# EAGLE design mainboard (EAGLE 5.11)

## Sheet 1 of 3
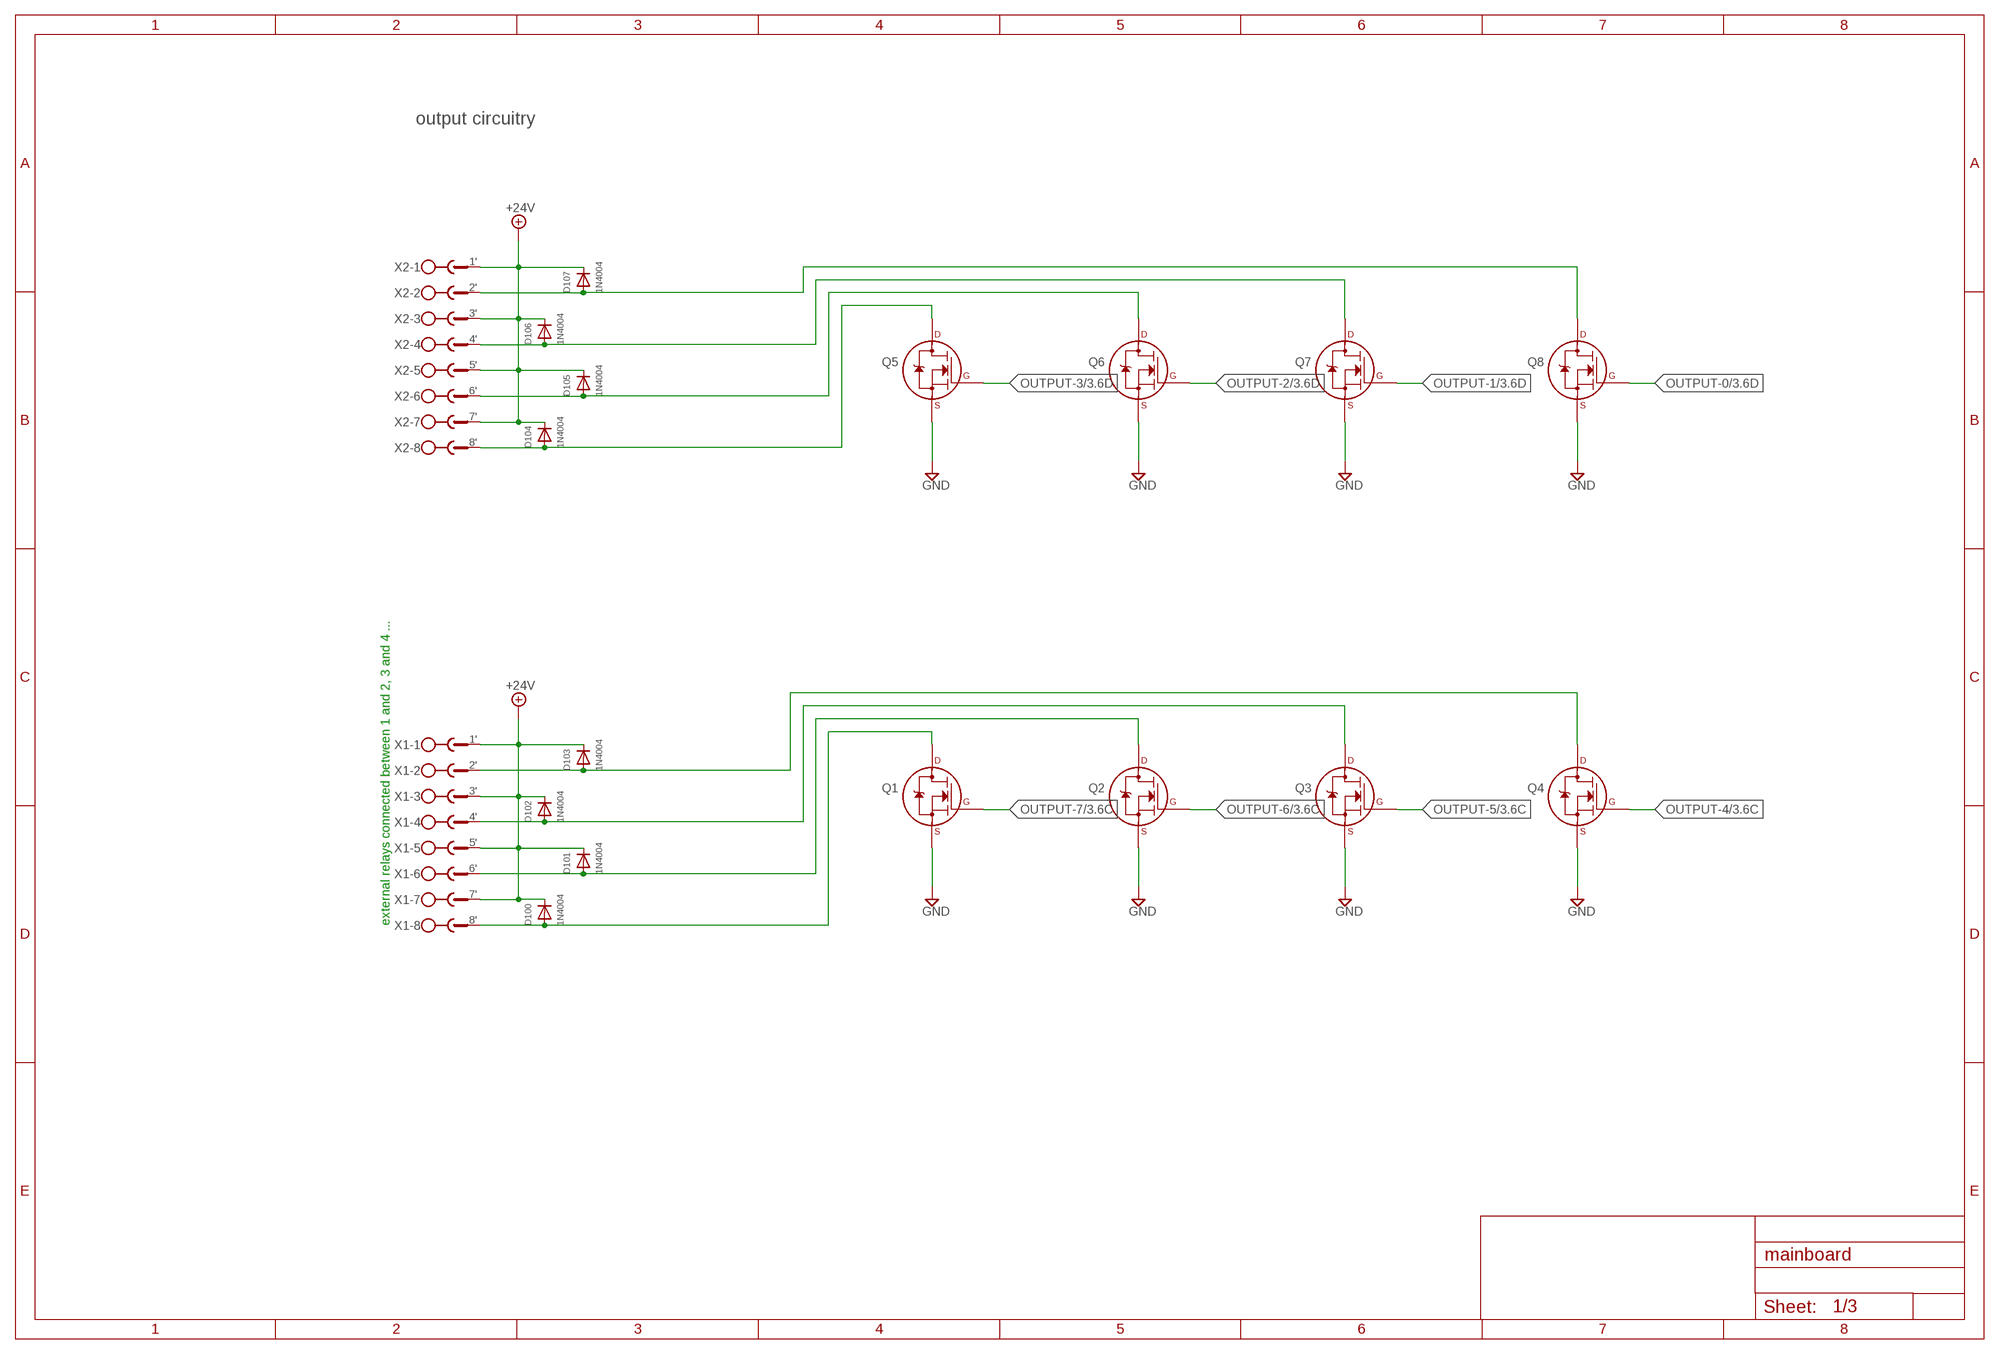
[diagram p0: schematic, sheet 1]

### Parts
D100  1N4004  DIODESMA  [SMADIODE]
D101  1N4004  DIODESMA  [SMADIODE]
D102  1N4004  DIODESMA  [SMADIODE]
D103  1N4004  DIODESMA  [SMADIODE]
D104  1N4004  DIODESMA  [SMADIODE]
D105  1N4004  DIODESMA  [SMADIODE]
D106  1N4004  DIODESMA  [SMADIODE]
D107  1N4004  DIODESMA  [SMADIODE]
Q1  2N7000_TO92  [TO-92]
Q2  2N7000_TO92  [TO-92]
Q3  2N7000_TO92  [TO-92]
Q4  2N7000_TO92  [TO-92]
Q5  2N7000_TO92  [TO-92]
Q6  2N7000_TO92  [TO-92]
Q7  2N7000_TO92  [TO-92]
Q8  2N7000_TO92  [TO-92]
X1  MSTBA8  [MSTBA8]
X2  MSTBA8  [MSTBA8]

### Nets
+24V: D100.C D101.C D102.C D103.C D104.C D105.C D106.C D107.C X1.1' X1.3' X1.5' X1.7' X2.1' X2.3' X2.5' X2.7' ; also sheet 2,3
GND: Q1.1(S) Q2.1(S) Q3.1(S) Q4.1(S) Q5.1(S) Q6.1(S) Q7.1(S) Q8.1(S) ; also sheet 2,3
N$2: D107.A Q8.3(D) X2.2'
N$4: D105.A Q6.3(D) X2.6'
N$5: D104.A Q5.3(D) X2.8'
N$6: D103.A Q4.3(D) X1.2'
N$8: D101.A Q2.3(D) X1.6'
N$9: D100.A Q1.3(D) X1.8'
N$11: D106.A Q7.3(D) X2.4'
N$12: D102.A Q3.3(D) X1.4'
OUTPUT-0: Q8.2(G) ; also sheet 3
OUTPUT-1: Q7.2(G) ; also sheet 3
OUTPUT-2: Q6.2(G) ; also sheet 3
OUTPUT-3: Q5.2(G) ; also sheet 3
OUTPUT-4: Q4.2(G) ; also sheet 3
OUTPUT-5: Q3.2(G) ; also sheet 3
OUTPUT-6: Q2.2(G) ; also sheet 3
OUTPUT-7: Q1.2(G) ; also sheet 3

### Notes on the sheet
- output circuitry
- external relays connected between 1 and 2, 3 and 4 ...

## Sheet 2 of 3
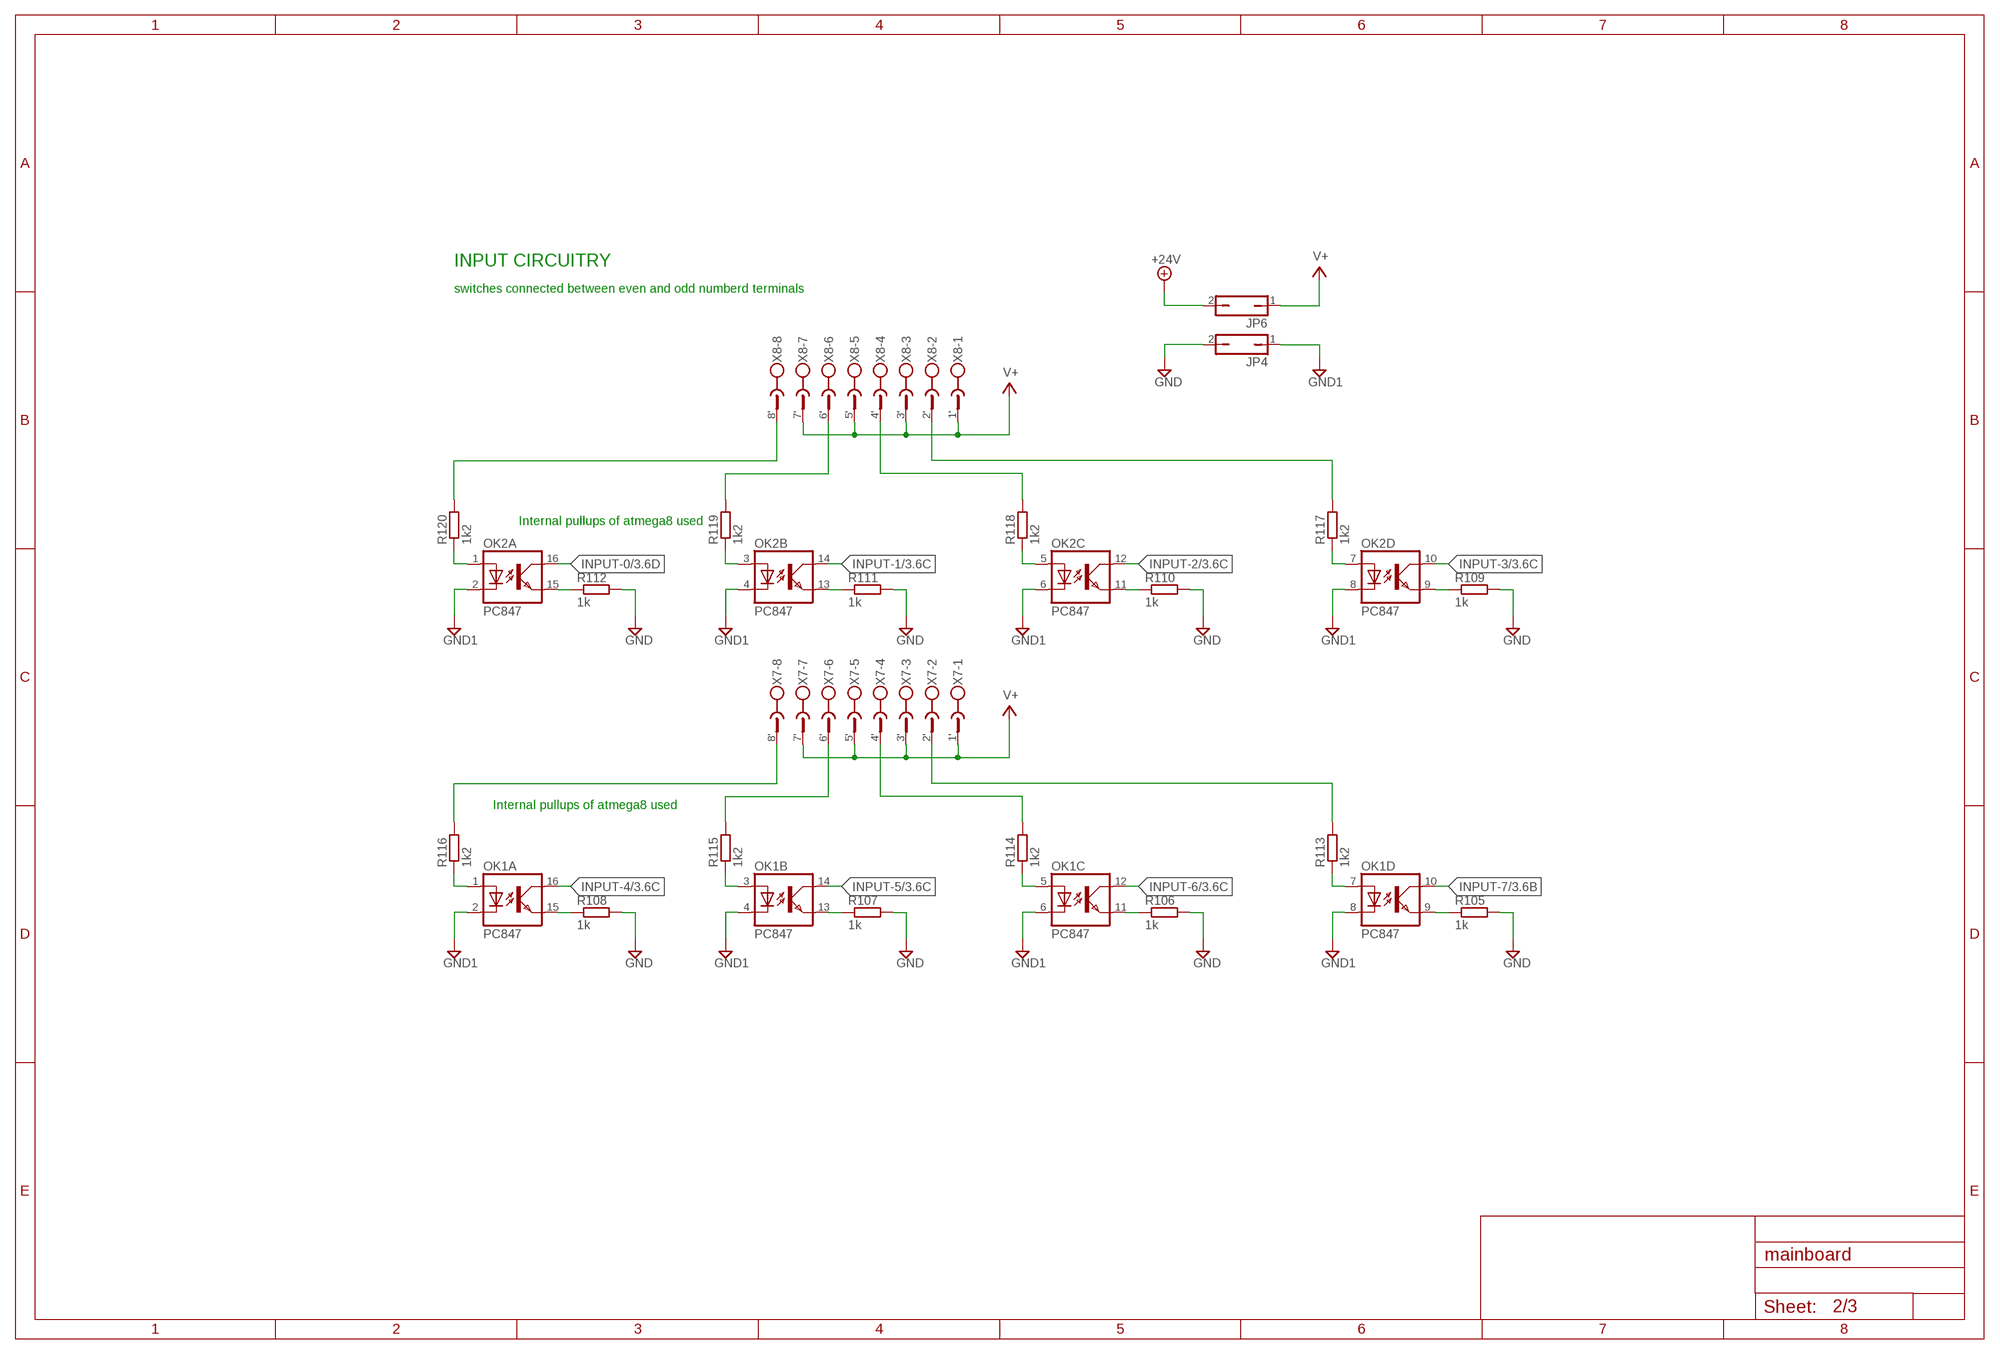
[diagram p1: schematic, sheet 2]

### Parts
JP4  JP1Q  [JP1]
JP6  JP1Q  [JP1]
OK1  PC847  [DIL16]
OK2  PC847  [DIL16]
R105  1k  R-EU_R0805  [R0805]
R106  1k  R-EU_R0805  [R0805]
R107  1k  R-EU_R0805  [R0805]
R108  1k  R-EU_R0805  [R0805]
R109  1k  R-EU_R0805  [R0805]
R110  1k  R-EU_R0805  [R0805]
R111  1k  R-EU_R0805  [R0805]
R112  1k  R-EU_R0805  [R0805]
R113  1k2  R-EU_R1206  [R1206]
R114  1k2  R-EU_R1206  [R1206]
R115  1k2  R-EU_R1206  [R1206]
R116  1k2  R-EU_R1206  [R1206]
R117  1k2  R-EU_R1206  [R1206]
R118  1k2  R-EU_R1206  [R1206]
R119  1k2  R-EU_R1206  [R1206]
R120  1k2  R-EU_R1206  [R1206]
X7  MSTBA8  [MSTBA8]
X8  MSTBA8  [MSTBA8]

### Nets
+24V: JP6.2 ; also sheet 1,3
GND: JP4.2 R105.2 R106.2 R107.2 R108.2 R109.2 R110.2 R111.2 R112.2 ; also sheet 1,3
GND1: JP4.1 OK1.2(A:C) OK1.4(B:C) OK1.6(C:C) OK1.8(D:C) OK2.2(A:C) OK2.4(B:C) OK2.6(C:C) OK2.8(D:C) ; also sheet 3
INPUT-0: OK2.16(A:COL) ; also sheet 3
INPUT-1: OK2.14(B:COL) ; also sheet 3
INPUT-2: OK2.12(C:COL) ; also sheet 3
INPUT-3: OK2.10(D:COL) ; also sheet 3
INPUT-4: OK1.16(A:COL) ; also sheet 3
INPUT-5: OK1.14(B:COL) ; also sheet 3
INPUT-6: OK1.12(C:COL) ; also sheet 3
INPUT-7: OK1.10(D:COL) ; also sheet 3
N$1: OK2.1(A:A) R120.1
N$3: OK2.3(B:A) R119.1
N$7: OK2.5(C:A) R118.1
N$10: OK2.7(D:A) R117.1
N$14: R120.2 X8.8'
N$15: R119.2 X8.6'
N$16: R118.2 X8.4'
N$17: R117.2 X8.2'
N$18: OK1.1(A:A) R116.1
N$19: OK1.3(B:A) R115.1
N$20: OK1.5(C:A) R114.1
N$21: OK1.7(D:A) R113.1
N$22: R116.2 X7.8'
N$23: R115.2 X7.6'
N$24: R114.2 X7.4'
N$25: R113.2 X7.2'
N$44: OK2.15(A:EMIT) R112.1
N$45: OK2.13(B:EMIT) R111.1
N$46: OK2.11(C:EMIT) R110.1
N$47: OK2.9(D:EMIT) R109.1
N$48: OK1.15(A:EMIT) R108.1
N$49: OK1.13(B:EMIT) R107.1
N$50: OK1.11(C:EMIT) R106.1
N$51: OK1.9(D:EMIT) R105.1
V+: JP6.1 X7.1' X7.3' X7.5' X7.7' X8.1' X8.3' X8.5' X8.7' ; also sheet 3

### Notes on the sheet
- INPUT CIRCUITRY
- switches connected between even and odd numberd terminals
- Internal pullups of atmega8 used
- Internal pullups of atmega8 used

## Sheet 3 of 3
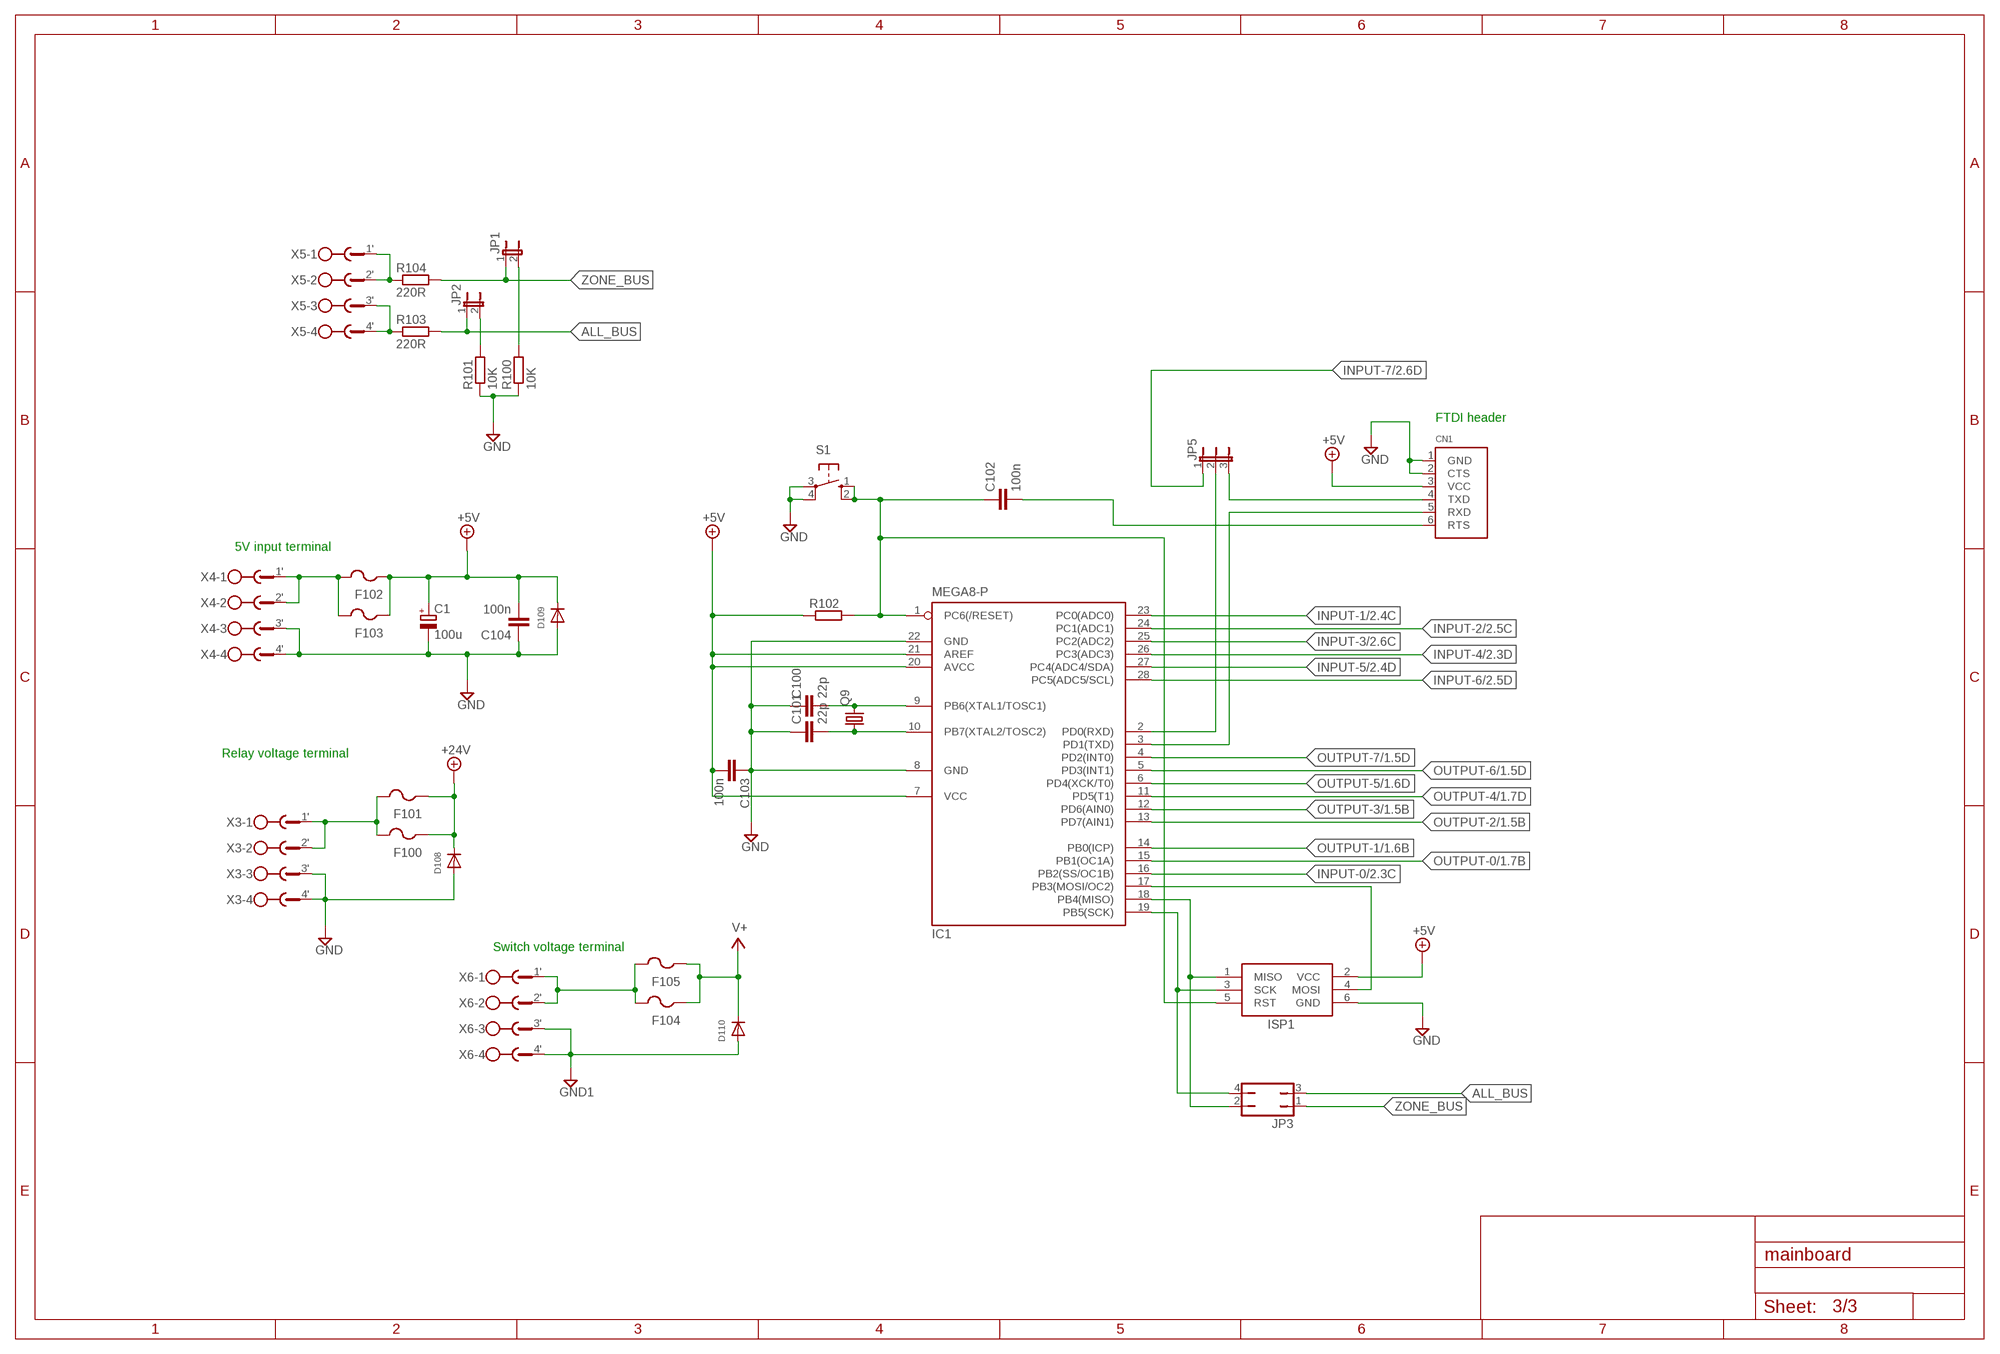
[diagram p2: schematic, sheet 3]

### Parts
C1  100u  CPOL-EUE5-8.5  [E5-8,5]
C100  22p  C-EUC0805  [C0805]
C101  22p  C-EUC0805  [C0805]
C102  100n  C-EUC0805  [C0805]
C103  100n  C-EUC0805  [C0805]
C104  100n  C-EUC0805  [C0805]
CN1  FTDIUSBCABLE  [1X06_ROUND]
D108  DIODESMA  [SMADIODE]
D109  DIODESMA  [SMADIODE]
D110  DIODESMA  [SMADIODE]
F100  PTCFUSE-1206  [R1206]
F101  PTCFUSE-1812  [1812]
F102  PTCFUSE-1812  [1812]
F103  PTCFUSE-1206  [R1206]
F104  PTCFUSE-1206  [R1206]
F105  PTCFUSE-1812  [1812]
IC1  MEGA8-P  [DIL28-3]
ISP1  AVRISP-6  [AVRISP]
JP1  JP1E  [JP1]
JP2  JP1E  [JP1]
JP3  JP2Q  [JP2Q]
JP5  JP2E  [JP2]
Q9  CRYSTALHC49S  [HC49/S]
R100  10K  R-EU_R0805  [R0805]
R101  10K  R-EU_R0805  [R0805]
R102  R-EU_R0805  [R0805]
R103  220R  R-EU_R0805  [R0805]
R104  220R  R-EU_R0805  [R0805]
S1  10-XX  [B3F-10XX]
X3  MSTBA4  [MSTBA4]
X4  MSTBA4  [MSTBA4]
X5  MSTBA4  [MSTBA4]
X6  MSTBA4  [MSTBA4]

### Nets
+5V: C1.+ C103.2 C104.2 CN1.3(VCC) D109.C F102.1 F103.1 IC1.7(VCC) IC1.20(AVCC) IC1.21(AREF) ISP1.2(VCC) R102.1
+24V: D108.C F100.1 F101.1 ; also sheet 1,2
ALL_BUS: JP2.1 JP3.3 R103.2
ALL_EXTERNAL: R103.1 X5.3' X5.4'
GND: C1.- C100.1 C101.1 C103.1 C104.1 CN1.1(GND) CN1.2(CTS) D108.A D109.A IC1.8(GND) IC1.22(GND) ISP1.6(GND) R100.1 R101.1 S1.3(P) S1.4(P1) X3.3' X3.4' X4.3' X4.4' ; also sheet 1,2
GND1: D110.A X6.3' X6.4' ; also sheet 2
INPUT-0: IC1.16(PB2(SS/OC1B)) ; also sheet 2
INPUT-1: IC1.23(PC0(ADC0)) ; also sheet 2
INPUT-2: IC1.24(PC1(ADC1)) ; also sheet 2
INPUT-3: IC1.25(PC2(ADC2)) ; also sheet 2
INPUT-4: IC1.26(PC3(ADC3)) ; also sheet 2
INPUT-5: IC1.27(PC4(ADC4/SDA)) ; also sheet 2
INPUT-6: IC1.28(PC5(ADC5/SCL)) ; also sheet 2
INPUT-7: JP5.1 ; also sheet 2
N$13: C102.1 IC1.1(PC6(/RESET)) ISP1.5(RST) R102.2 S1.1(S) S1.2(S1)
N$26: C101.2 IC1.10(PB7(XTAL2/TOSC2)) Q9.1
N$27: C100.2 IC1.9(PB6(XTAL1/TOSC1)) Q9.2
N$29: C102.2 CN1.6(RTS)
N$30: CN1.4(TXD) JP5.3
N$32: IC1.18(PB4(MISO)) ISP1.1(MISO) JP3.2
N$33: IC1.19(PB5(SCK)) ISP1.3(SCK) JP3.4
N$34: F100.2 F101.2 X3.1' X3.2'
N$35: IC1.17(PB3(MOSI/OC2)) ISP1.4(MOSI)
N$36: F104.2 F105.2 X6.1' X6.2'
N$41: F102.2 F103.2 X4.1' X4.2'
N$42: JP2.2 R101.2
N$43: JP1.2 R100.2
OUTPUT-0: IC1.15(PB1(OC1A)) ; also sheet 1
OUTPUT-1: IC1.14(PB0(ICP)) ; also sheet 1
OUTPUT-2: IC1.13(PD7(AIN1)) ; also sheet 1
OUTPUT-3: IC1.12(PD6(AIN0)) ; also sheet 1
OUTPUT-4: IC1.11(PD5(T1)) ; also sheet 1
OUTPUT-5: IC1.6(PD4(XCK/T0)) ; also sheet 1
OUTPUT-6: IC1.5(PD3(INT1)) ; also sheet 1
OUTPUT-7: IC1.4(PD2(INT0)) ; also sheet 1
RX: IC1.2(PD0(RXD)) JP5.2
TX: CN1.5(RXD) IC1.3(PD1(TXD))
V+: D110.C F104.1 F105.1 ; also sheet 2
ZONE_BUS: JP1.1 JP3.1 R104.2
ZONE_EXTERNAL: R104.1 X5.1' X5.2'

### Notes on the sheet
- FTDI header
- 5V input terminal
- Relay voltage terminal
- Switch voltage terminal

## Library data of the parts
C1 = resistor:CPOL-EU: POLARIZED CAPACITOR, European symbol
C100-C104 = resistor:C-EU: CAPACITOR, European symbol
CN1 = microbuilder:FTDIUSBCABLE: FTDI TTL-232R USB Cable Connector for FTDI's USB->RS232 Cable
D100-D108 D110 = microbuilder:DIODE: Diode
D109 = adafruit:DIODE: Diode
F100-F105 = adafruit:PTCFUSE: PTC fuses, resettable thermistors
IC1 = atmel:MEGA8-P: MICROCONTROLLER 8 Kbytes FLASH, 1 kbytes SRAM, 512 bytes EEPROM, USART, 4-channel 10 bit ADC, 2-channel 8 bit ADC Pin compatible with Atmega48, ATMega88, ATMega168 Source: avr.lbr; OC_FARNELL: unknown; OC_NEWARK: unknown
ISP1 = adafruit:AVRISP: AVR ISP HEADER Standard 6 pin header for AVR programming
JP1 JP2 = jumper:JP1E: JUMPER
JP3 = jumper:JP2Q: JUMPER
JP4 JP6 = jumper:JP1Q: JUMPER
JP5 = jumper:JP2E: JUMPER
OK1 OK2 = optocoupler:PC847: SHARP OPTO COUPLER; OC_FARNELL: 9707735; OC_NEWARK: unknown
Q1-Q8 = transistors2:2N700*: 2N7000, 2N7002, NDS7002A N-channel enhancement mode MOSFET
Q9 = crystal:CRYSTAL: CRYSTAL; OC_FARNELL: 1667008; OC_NEWARK: unknown
R100-R120 = resistor:R-EU_: RESISTOR, European symbol
S1 = switch-omron:10-XX: OMRON SWITCH; MPN: B3F-1000; OC_FARNELL: 176432; OC_NEWARK: 36M3542
X1 X2 X7 X8 = con-phoenix-508-mod:MSTBA8: PHOENIX; MF: FARNELL; MPN: 1757307; OC_FARNELL: 3705225; OC_NEWARK: 71C4166
X3-X6 = con-phoenix-508-mod:MSTBA4: PHOENIX; MF: FARNELL; MPN: 1757268; OC_FARNELL: 3705195; OC_NEWARK: 71C4163

## Board
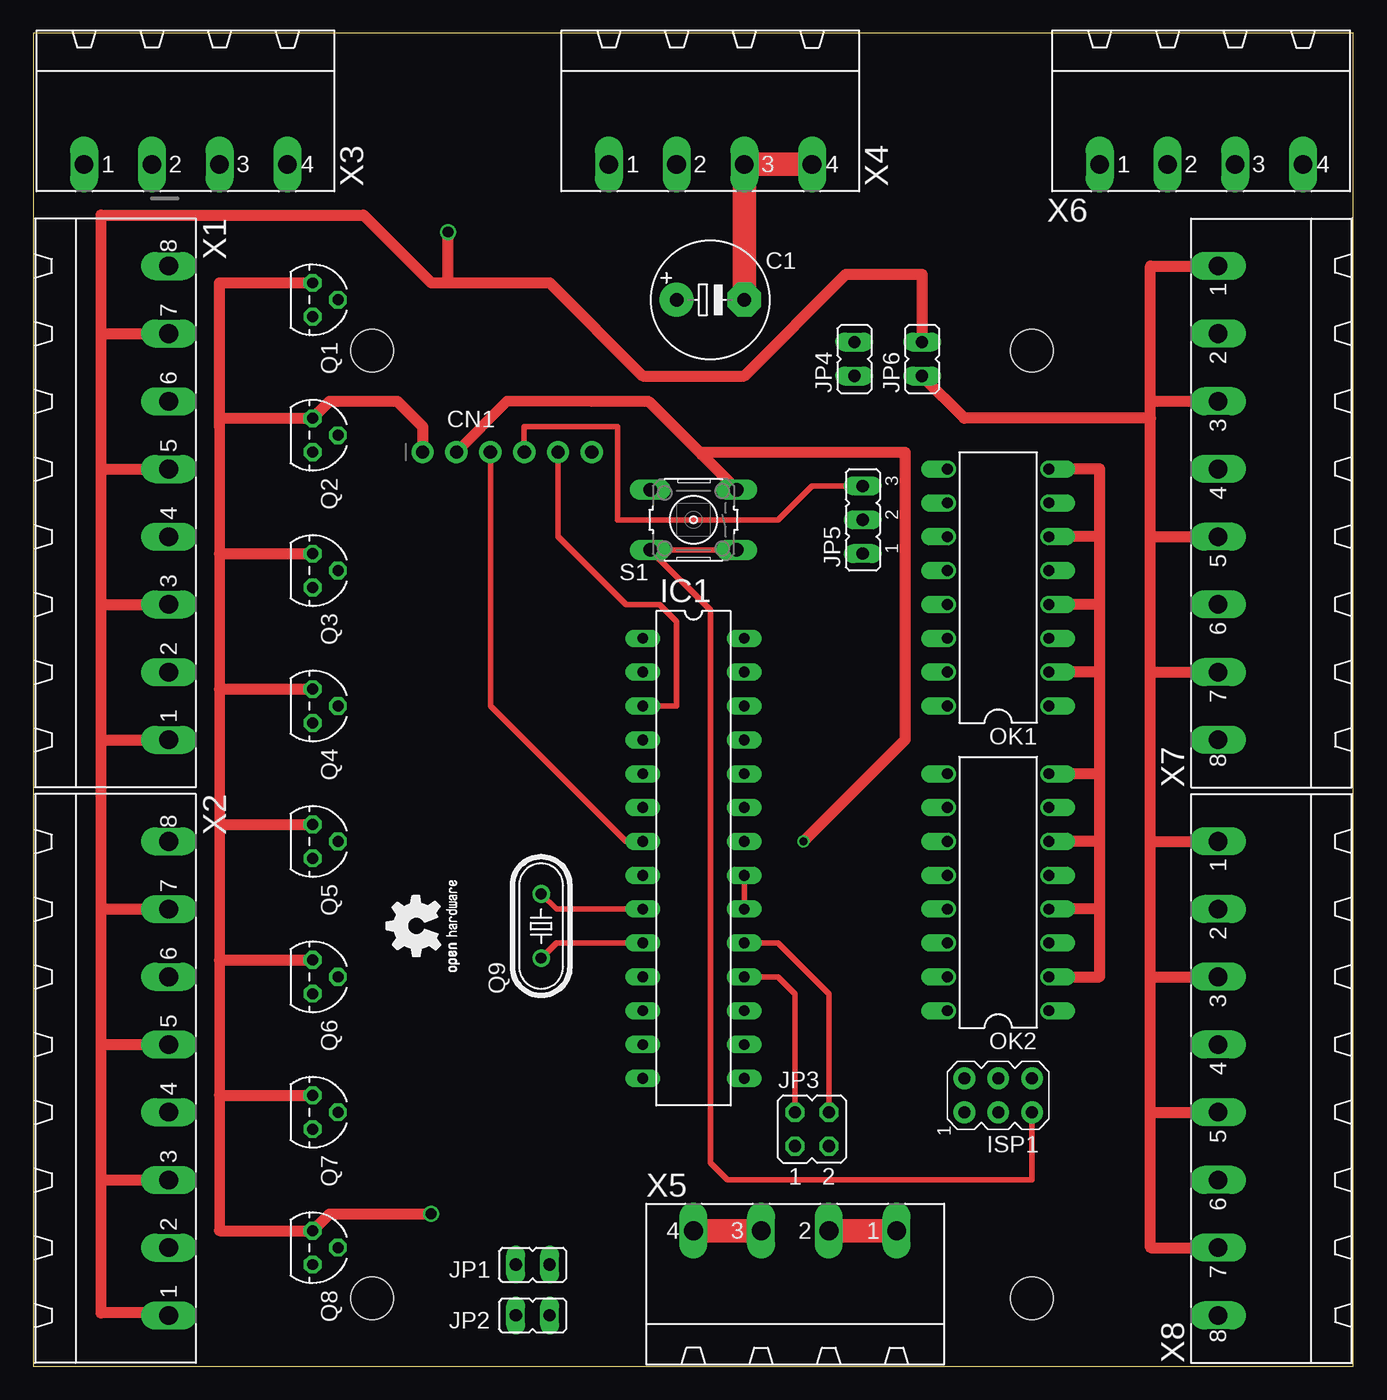
[diagram p3: board, top side]
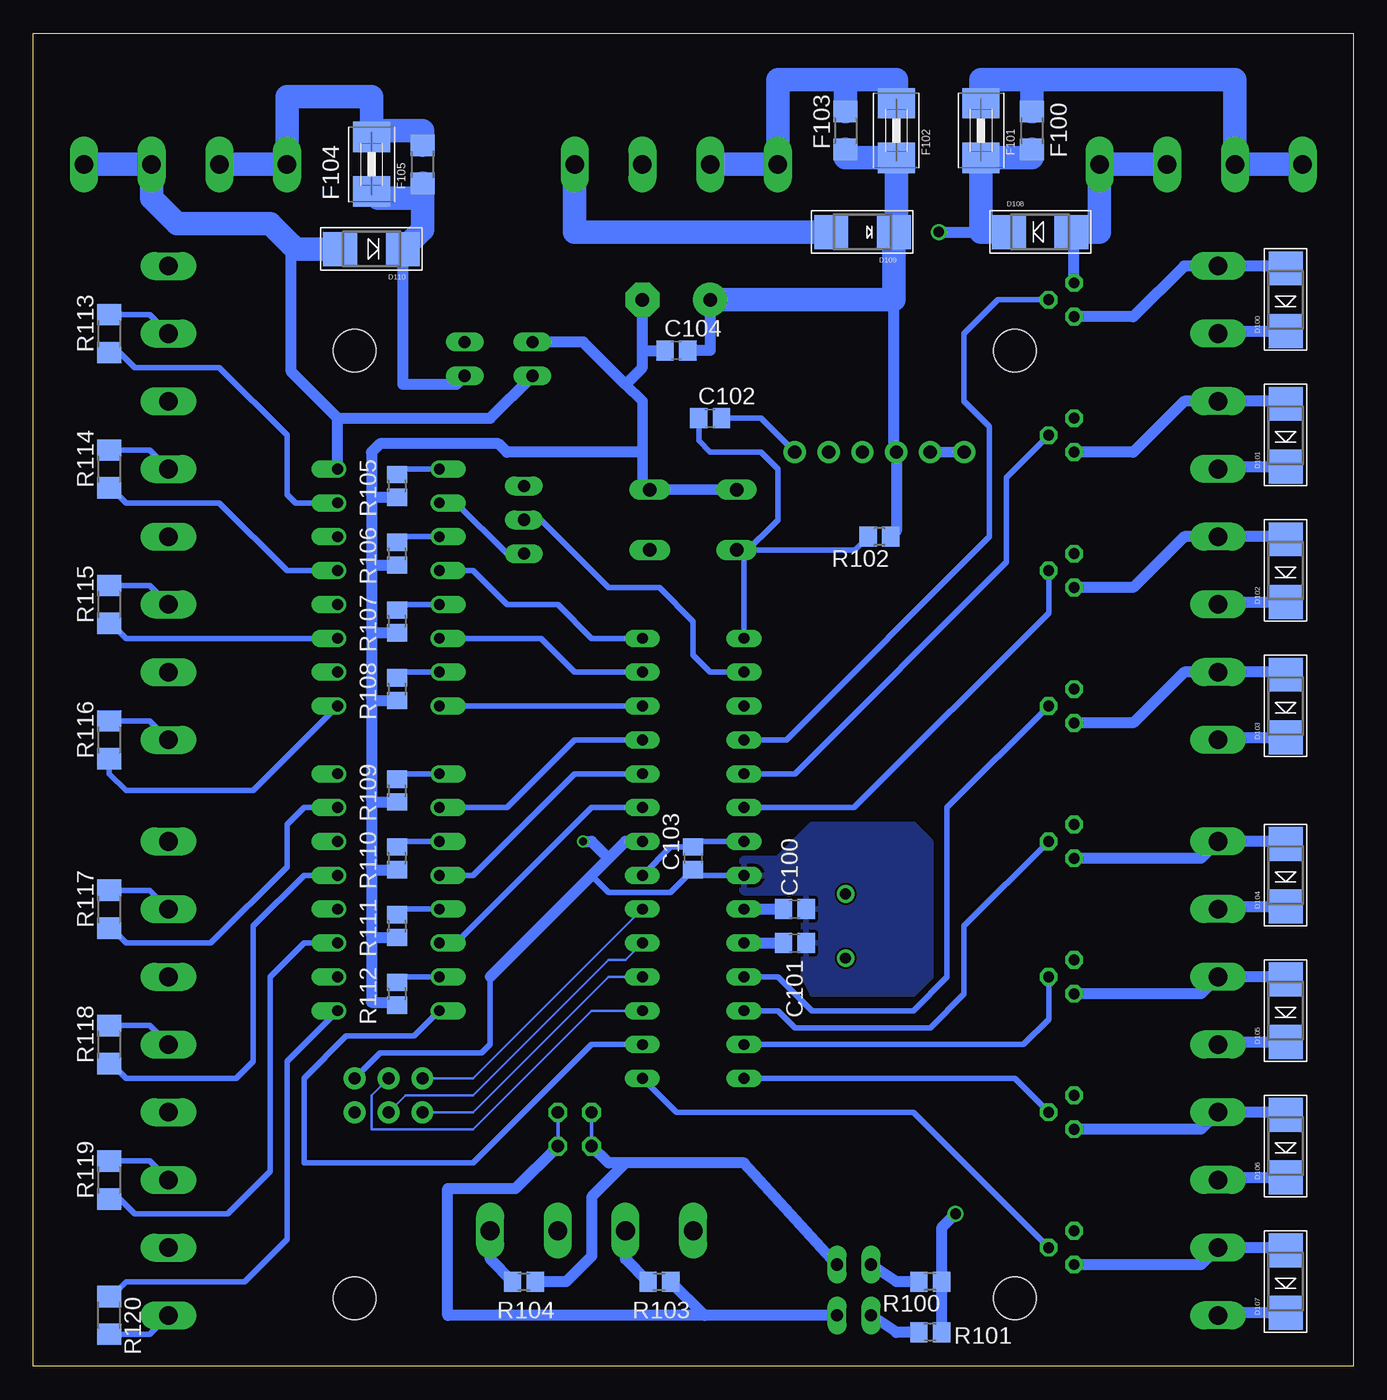
[diagram p4: board, bottom side, seen from below]

Size 99.04 x 100 mm. Coordinates in mm from the lower left corner, seen from the top.
Outline: 0,0 99.04,0 99.04,100 0,100 0,0
Copper layers (1*16): Top 0.035mm / dielectric 1.5mm / Bottom 0.035mm
Design rules "ITEADstudio_DRC": minimum track width 6mil, minimum drill 12mil, track to track 6mil, track to pad 6mil, pad to pad 6mil, via to via 6mil, smd to smd 0mil, copper to edge 10mil, drill to drill 10mil, minimum pad ring 10mil, minimum via ring 6mil, stop-mask expansion 2mil, vias tented up to drill 100mil, thermal gap 10mil
Holes 3.2 mm at 25.4,76.2 74.93,76.2 25.4,5.08 74.93,5.08

### Footprints (pad centres in the part's own frame; a part is rotated, then mirrored left to right if it is on the bottom)
E5-8,5 = drill 1.016 pad 2.54 round: + -2.54,0 | drill 1.016 pad 2.54 octagon: - 2.54,0
C0805 = smd 1.3 x 1.5: 1 -0.85,0; 2 0.85,0
1X06_ROUND = drill 1 pad 1.676 round: 1 -6.35,0; 2 -3.81,0; 3 -1.27,0; 4 1.27,0; 5 3.81,0; 6 6.35,0
SMADIODE = smd 2.54 x 2.54: A 2.349,0; C -2.349,0
R1206 = smd 1.6 x 1.803: 1 -1.422,0; 2 1.422,0
1812 = smd 2.286 x 2.794: 1 -2.046,0; 2 2.046,0
DIL28-3 = drill 0.813 long: 1 -16.51,-3.81; 2 -13.97,-3.81; 3 -11.43,-3.81; 4 -8.89,-3.81; 5 -6.35,-3.81; 6 -3.81,-3.81; 7 -1.27,-3.81; 8 1.27,-3.81; 9 3.81,-3.81; 10 6.35,-3.81; 11 8.89,-3.81; 12 11.43,-3.81; 13 13.97,-3.81; 14 16.51,-3.81; 15 16.51,3.81; 16 13.97,3.81; 17 11.43,3.81; 18 8.89,3.81; 19 6.35,3.81; 20 3.81,3.81; 21 1.27,3.81; 22 -1.27,3.81; 23 -3.81,3.81; 24 -6.35,3.81; 25 -8.89,3.81; 26 -11.43,3.81; 27 -13.97,3.81; 28 -16.51,3.81
AVRISP = drill 0.9 pad 1.626 round: 1 -1.27,2.54; 2 1.27,2.54; 3 -1.27,0; 4 1.27,0; 5 -1.27,-2.54; 6 1.27,-2.54
JP1 = drill 0.914 long: 1 0,-1.27; 2 0,1.27
JP2Q = drill 0.914 octagon: 1 -1.27,-1.27; 2 -1.27,1.27; 3 1.27,-1.27; 4 1.27,1.27
JP2 = drill 0.914 long: 1 -2.54,0; 2 0,0; 3 2.54,0
DIL16 = drill 0.813 offset: 1 -8.89,-3.81; 2 -6.35,-3.81; 3 -3.81,-3.81; 4 -1.27,-3.81; 5 1.27,-3.81; 6 3.81,-3.81; 7 6.35,-3.81; 8 8.89,-3.81; 9 8.89,3.81; 10 6.35,3.81; 11 3.81,3.81; 12 1.27,3.81; 13 -1.27,3.81; 14 -3.81,3.81; 15 -6.35,3.81; 16 -8.89,3.81
TO-92 = drill 0.813 octagon: 1 -1.27,0; 2 0,1.905; 3 1.27,0
HC49/S = drill 0.813 round: 1 -2.413,0; 2 2.413,0
R0805 = smd 1.3 x 1.5: 1 -0.85,0; 2 0.85,0
B3F-10XX = drill 1.016 long: 1 -3.251,2.261; 2 3.251,2.261; 3 -3.251,-2.261; 4 3.251,-2.261
MSTBA8 = drill 1.397 long: 1' 17.78,5.08; 2' 12.7,5.08; 3' 7.62,5.08; 4' 2.54,5.08; 5' -2.54,5.08; 6' -7.62,5.08; 7' -12.7,5.08; 8' -17.78,5.08
MSTBA4 = drill 1.397 long: 1' 7.62,5.08; 2' 2.54,5.08; 3' -2.54,5.08; 4' -7.62,5.08

### Placement (x,y rotation side)
C1  50.8,80.01 0 top
C100  41.91,34.29 180 bottom
C101  41.91,31.75 180 bottom
C102  48.26,71.12 0 bottom
C103  49.53,38.1 90 bottom
C104  50.8,76.2 0 bottom
CN1  35.56,68.58 0 top
D100  5.08,80.01 90 bottom
D101  5.08,69.85 90 bottom
D102  5.08,59.69 90 bottom
D103  5.08,49.53 90 bottom
D104  5.08,36.83 90 bottom
D105  5.08,26.67 90 bottom
D106  5.08,16.51 90 bottom
D107  5.08,6.35 90 bottom
D108  23.5,85.09 0 bottom
D109  36.83,85.09 180 bottom
D110  73.66,83.82 180 bottom
F100  24.13,92.71 90 bottom
F101  27.94,92.71 90 bottom
F102  34.29,92.71 90 bottom
F103  38.1,92.71 90 bottom
F104  69.85,90.17 90 bottom
F105  73.66,90.17 90 bottom
IC1  49.53,38.1 270 top
ISP1  72.39,20.32 90 top
JP1  37.47,7.62 90 top
JP2  37.47,3.81 90 top
JP3  58.42,17.78 0 top
JP4  61.59,75.56 0 top
JP5  62.23,63.5 90 top
JP6  66.67,75.56 0 top
OK1  72.39,58.42 90 top
OK2  72.39,35.56 90 top
Q1  20.95,80.01 270 top
Q2  20.95,69.85 270 top
Q3  20.95,59.69 270 top
Q4  20.95,49.53 270 top
Q5  20.95,39.37 270 top
Q6  20.95,29.21 270 top
Q7  20.95,19.05 270 top
Q8  20.95,8.89 270 top
Q9  38.1,33.02 90 top
R100  31.75,6.35 180 bottom
R101  31.75,2.54 180 bottom
R102  35.56,62.23 180 bottom
R103  52.07,6.35 0 bottom
R104  62.23,6.35 0 bottom
R105  71.75,66.04 270 bottom
R106  71.75,60.96 270 bottom
R107  71.75,55.88 270 bottom
R108  71.75,50.8 270 bottom
R109  71.75,43.18 270 bottom
R110  71.75,38.1 270 bottom
R111  71.75,33.02 270 bottom
R112  71.75,27.94 270 bottom
R113  93.34,77.47 90 bottom
R114  93.34,67.31 90 bottom
R115  93.34,57.15 90 bottom
R116  93.34,46.99 90 bottom
R117  93.34,34.29 90 bottom
R118  93.34,24.13 90 bottom
R119  93.34,13.97 90 bottom
R120  93.34,3.81 270 bottom
S1  49.53,63.5 180 top
U$1  [OSHW2]  33.02,29.21 90 top
X1  5.08,64.77 270 top
X2  5.08,21.59 270 top
X3  11.43,95.25 180 top
X4  50.8,95.25 180 top
X5  57.15,5.08 0 top
X6  87.63,95.25 180 top
X7  93.98,64.77 90 top
X8  93.98,21.59 90 top

### Tracks (layer width: path | path; a pad name or v marks a point on that pad's centre or on a via)
+5V
  Top 0.4: CN1.3 34.29,49.53 44.45,39.37 IC1.7
  Top 0.406: IC1.21 IC1.20
  Bottom 0.2: IC1.20 66.04,21.59 ISP1.2
  Bottom 0.406: IC1.7 49.11,39.37 C103.2 51.22,38.95 IC1.21
  Bottom 0.813: C104.2 48.26,76.2 C1.+ | 34.48,80.01 34.48,68.77 CN1.3 34.29,62.65 R102.1
  Bottom 1.778: F103.1 38.1,90.66 F102.1 34.29,85.09 D109.C 34.48,80.01 C1.+
+24V  (via drill 0.8)
  Top 0.813: 5.08,77.47 X1.7' | 5.08,13.97 D107.C 10.16,4 X2.1' | 5.08,13.97 5.08,24.13 | 5.08,24.13 5.08,34.29 | 5.08,34.29 5.08,46.99 | 5.08,46.99 5.08,57.15 | 5.08,57.15 5.08,67.31 | 5.08,67.31 5.08,77.47 | 5.08,67.31 X1.5' | 5.08,57.15 X1.3' | 5.08,46.99 X1.1' | 5.08,34.29 X2.7' | 5.08,24.13 X2.5' | 5.08,13.97 X2.3' | 5.08,77.47 5.08,86.36 24.77,86.36 29.84,81.28 31.11,81.28 | 31.11,81.28 38.73,81.28 45.72,74.3 53.34,74.3 60.96,81.92 66.67,81.92 JP6.2 | 31.11,81.28 v31.11,85.09
  Bottom 0.813: D107.C 9.97,4 X2.1' | D106.C 9.97,14.16 X2.3' | D105.C 9.97,24.32 X2.5' | D104.C 9.97,34.48 X2.7' | D103.C 9.97,47.18 X1.1' | D102.C 9.97,57.34 X1.3' | D101.C 9.97,67.5 X1.5' | D100.C 9.97,77.66 X1.7' | v31.11,85.09 27.94,85.09
  Bottom 1.778: D108.C 27.94,85.09 F101.1 24.13,90.66 F100.1
ALL_BUS
  Bottom 0.254: JP3.3 59.69,19.05
  Bottom 0.813: 48.68,3.81 R103.2 | JP2.1 48.68,3.81 | 48.68,3.81 67.94,3.81 67.94,13.34 62.87,13.34 JP3.3
ALL_EXTERNAL
  Top 1.778: X5.3' X5.4'
  Bottom 0.813: X5.3' 54.61,8.04 R103.1
GND  (via drill 0.6, 0.8)
  Top 0.8: 13.97,10.16 13.97,20.32 13.97,30.48 13.97,40.64 13.97,50.8 13.97,60.96 13.97,70.48 13.97,71.12 | S1.4 46,65.76 | 41.91,72.39 35.56,72.39 CN1.2
  Top 0.813: 13.97,71.12 Q2.1 22.23,72.39 27.3,72.39 29.21,70.48 CN1.1 | 13.97,60.96 Q3.1 | 13.97,50.8 Q4.1 | 13.97,40.64 Q5.1 | 13.97,30.48 Q6.1 | 13.97,20.32 Q7.1 | 13.97,10.16 Q8.1 22.23,11.43 v29.84,11.43 | Q1.1 13.97,81.28 13.97,70.48 | 41.91,72.39 46.15,72.39 50.15,68.39 | 50.15,68.39 S1.3 | v57.78,39.37 65.41,46.99 65.41,68.58 50.15,68.58 50.15,68.39
  Top 1.778: X4.4' X4.3' C1.-
  Bottom 0.406: 57.15,36.83 55.88,35.56 51.22,35.56 C103.1 49.11,36.83 IC1.8 | 64.77,29.21 64.77,24.13 65.41,23.5 73.03,23.5 ISP1.6
  Bottom 0.8: CN1.1 CN1.2 | 54.61,73.66 53.34,72.39 53.34,68.58 53.34,66.32 S1.3 S1.4
  Bottom 0.813: 64.77,29.21 57.15,36.83 55.88,38.1 | 55.88,38.1 54.61,39.37 IC1.22 | R101.1 R100.1 30.9,10.38 v29.84,11.43 | 53.34,68.58 63.5,68.58 64.14,69.22 73.03,69.22 73.66,68.58 73.66,65.41 | 73.66,65.41 73.66,60.33 | 73.66,60.33 73.66,55.24 | 73.66,55.24 73.66,50.16 | 73.66,50.16 73.66,42.55 | 73.66,42.55 73.66,37.47 | 73.66,37.47 73.66,32.38 | 73.66,32.38 73.66,27.3 71.97,27.3 R112.2 | R111.2 73.44,32.17 73.66,32.38 | R110.2 73.44,37.25 73.66,37.47 | R109.2 73.44,42.33 73.66,42.55 | R108.2 73.44,49.95 73.66,50.16 | R107.2 73.44,55.03 73.66,55.24 | R106.2 73.44,60.11 73.66,60.33 | R105.2 73.44,65.19 73.66,65.41 | 53.34,76.2 C104.1 | 53.34,76.2 C1.- | 53.34,76.2 53.34,74.93 54.61,73.66 57.78,76.83 JP4.2 | Q1.1 20.95,84.9 D108.A | v57.78,39.37 57.15,39.37 55.88,38.1
  Bottom 1.778: X3.3' X3.4' 19.05,85.09 D108.A | D109.A 58.42,85.09 X4.4'
  pour Bottom: 45.72,38.1 43.18,38.1 40.64,40.64 33.02,40.64 31.75,39.37 31.75,29.21 33.02,27.94 40.64,27.94 41.27,29.21 41.27,35.56 45.72,35.56 46.99,36.83
GND1
  Top 0.813: OK1.8 80.01,67.31 80.01,62.23 | 80.01,34.29 80.01,29.21 OK2.2 | 80.01,34.29 80.01,39.37 | 80.01,39.37 80.01,44.45 | 80.01,44.45 80.01,52.07 | 80.01,52.07 80.01,57.15 | 80.01,57.15 80.01,62.23 | 80.01,34.29 OK2.4 | 80.01,39.37 OK2.6 | 80.01,44.45 OK2.8 | 80.01,52.07 OK1.2 | 80.01,57.15 OK1.4 | 80.01,62.23 OK1.6
  Bottom 0.813: OK1.8 76.2,71.12 | D110.A 76.2,83.82 | 76.2,71.12 79.69,74.61 79.69,84.14 | 76.2,71.12 64.77,71.12 JP4.1
  Bottom 1.778: X6.4' X6.3' 90.17,87.63 88.27,85.72 81.28,85.72 79.69,84.14 79.38,83.82 D110.A
INPUT-0
  Bottom 0.406: IC1.16 57.15,24.13 66.04,15.24 78.74,15.24 78.74,21.59 75.56,24.77 70.48,24.77 OK2.16
INPUT-1
  Bottom 0.406: IC1.23 57.15,41.91 67.31,31.75 OK2.14
INPUT-2
  Bottom 0.406: IC1.24 58.42,44.45 66.04,36.83 OK2.12
INPUT-3
  Bottom 0.406: IC1.25 58.42,46.99 63.5,41.91 OK2.10
INPUT-4
  Bottom 0.406: IC1.26 OK1.16
INPUT-5
  Bottom 0.406: IC1.27 58.42,52.07 60.96,54.61 OK1.14
INPUT-6
  Bottom 0.406: IC1.28 57.15,54.61 59.69,57.15 63.5,57.15 66.04,59.69 OK1.12
INPUT-7
  Bottom 0.406: JP5.1 63.5,60.96 67.31,64.77 OK1.10
N$1
  Bottom 0.406: R120.1 93.19,5.23 92.08,6.35 83.19,6.35 80.01,9.53 80.01,22.86 OK2.1
N$2
  Bottom 0.813: Q8.3 11.43,7.62 X2.2' 5.27,8.89 D107.A
N$3
  Bottom 0.406: R119.1 92.56,12.55 91.44,11.43 84.45,11.43 81.28,14.61 81.28,29.21 78.74,31.75 OK2.3
N$4
  Bottom 0.813: Q6.3 11.43,27.94 X2.6' 5.08,29.21 D105.A
N$5
  Bottom 0.813: Q5.3 11.43,38.1 X2.8' 5.27,39.37 D104.A
N$6
  Bottom 0.813: D103.A 5.27,52.07 X1.2' 12.7,52.07 16.51,48.26 Q4.3
N$7
  Bottom 0.406: R118.1 93.19,22.71 92.08,21.59 83.82,21.59 82.55,22.86 82.55,33.02 78.74,36.83 OK2.5
N$8
  Bottom 0.813: D101.A 5.27,72.39 X1.6' 12.7,72.39 16.51,68.58 Q2.3
N$9
  Bottom 0.813: D100.A 5.27,82.55 X1.8' 12.7,82.55 16.51,78.74 Q1.3
N$10
  Bottom 0.406: R117.1 93.19,32.87 92.08,31.75 85.72,31.75 80.01,37.47 80.01,40.64 78.74,41.91 OK2.7
N$11
  Bottom 0.813: Q7.3 11.43,17.78 X2.4' 5.27,19.05 D106.A
N$12
  Bottom 0.813: D102.A 5.27,62.23 X1.4' 12.7,62.23 16.51,58.42 Q3.3
N$13
  Top 0.4: ISP1.5 74.93,13.97 52.07,13.97 50.8,15.24 50.8,56.72 S1.2 S1.1
  Bottom 0.4: IC1.1 45.72,60.68 45.86,60.82 | 45.86,60.82 S1.2 37.4,61.24 R102.2 | C102.1 49.11,69.43 48.26,68.58 44.45,68.58 43.18,67.31 43.18,63.5 45.86,60.82
N$14
  Bottom 0.406: X8.8' 90.32,2.39 R120.2
N$15
  Bottom 0.406: X8.6' 90.32,15.39 R119.2
N$16
  Bottom 0.406: R118.2 90.32,25.55 X8.4'
N$17
  Bottom 0.406: R117.2 90.32,35.71 X8.2'
N$18
  Bottom 0.406: R116.1 93.34,44.45 92.08,43.18 82.55,43.18 OK1.1
N$19
  Bottom 0.406: R115.1 93.19,55.73 92.08,54.61 OK1.3
N$20
  Bottom 0.406: R114.1 93.19,65.89 92.08,64.77 85.09,64.77 80.01,59.69 OK1.5
N$21
  Bottom 0.406: R113.1 92.56,76.05 91.44,74.93 85.09,74.93 80.01,69.85 80.01,65.41 79.38,64.77 OK1.7
N$22
  Bottom 0.406: R116.2 90.32,48.41 X7.8'
N$23
  Bottom 0.406: R115.2 90.32,58.57 X7.6'
N$24
  Bottom 0.406: R114.2 90.32,68.73 X7.4'
N$25
  Bottom 0.406: R113.2 90.32,78.89 X7.2'
N$26
  Top 0.406: Q9.1 39.24,31.75 IC1.10
  Bottom 0.813: IC1.10 C101.2
N$27
  Top 0.406: Q9.2 39.24,34.29 IC1.9
  Bottom 0.813: IC1.9 C100.2
N$29
  Bottom 0.4: CN1.6 44.45,71.12 C102.2
N$30
  Top 0.406: JP5.3 58.42,66.04 55.88,63.5 43.81,63.5 43.81,70.48 36.83,70.48 CN1.4
N$32
  Top 0.406: JP3.2 57.15,27.94 55.88,29.21 IC1.18
  Bottom 0.2: ISP1.1 66.04,19.05 55.88,29.21 IC1.18
N$33
  Top 0.406: JP3.4 59.69,27.94 55.88,31.75 IC1.19
  Bottom 0.2: IC1.19 54.61,30.48 55.88,30.48 66.04,20.32 71.12,20.32 ISP1.3
N$34
  Bottom 1.778: X3.1' X3.2' 8.89,96.52 24.13,96.52 | 24.13,96.52 27.94,96.52 F101.2 | 24.13,96.52 F100.2
N$35
  Bottom 0.2: ISP1.4 73.66,20.32 73.66,17.78 66.04,17.78 57.15,26.67 IC1.17
N$36
  Bottom 1.778: X6.2' X6.1' 80.01,95.25 73.66,95.25 F105.2 73.17,92.71 69.85,92.71 F104.2
N$41
  Bottom 1.778: X4.2' X4.1' 43.18,96.52 38.1,96.52 | 38.1,96.52 34.29,96.52 F102.2 | 38.1,96.52 F103.2
N$42
  Bottom 0.813: JP2.2 34.29,2.54 R101.2
N$43
  Bottom 0.813: JP1.2 34.29,6.35 R100.2
N$44
  Bottom 0.406: OK2.15 71.33,29.21 R112.1
N$45
  Bottom 0.406: OK2.13 71.33,34.29 R111.1
N$46
  Bottom 0.406: OK2.11 71.33,39.37 R110.1
N$47
  Bottom 0.406: OK2.9 71.33,44.45 R109.1
N$48
  Bottom 0.406: OK1.15 71.33,52.07 R108.1
N$49
  Bottom 0.406: OK1.13 71.33,57.15 R107.1
N$50
  Bottom 0.406: OK1.11 71.33,62.23 R106.1
N$51
  Bottom 0.406: OK1.9 71.33,67.31 R105.1
OUTPUT-0
  Bottom 0.406: IC1.15 50.8,19.05 33.02,19.05 Q8.2
OUTPUT-1
  Bottom 0.4: 25.4,21.59 IC1.14
  Bottom 0.406: Q7.2 25.4,21.59
OUTPUT-2
  Bottom 0.4: 24.77,24.13 IC1.13
  Bottom 0.406: 24.77,24.13 22.86,26.04 Q6.2
OUTPUT-3
  Bottom 0.4: IC1.12 43.18,26.67 41.91,25.4 31.75,25.4 29.21,27.94 29.21,29.84
  Bottom 0.406: Q5.2 29.21,33.02 29.21,29.84
OUTPUT-4
  Bottom 0.4: IC1.11 43.18,29.21 40.64,26.67 33.02,26.67 30.48,29.21 30.48,38.73
  Bottom 0.406: Q4.2 30.48,41.91 30.48,38.73
OUTPUT-5
  Bottom 0.4: 37.47,41.91 IC1.6
  Bottom 0.406: Q3.2 22.86,56.52 37.47,41.91
OUTPUT-6
  Bottom 0.4: 41.91,44.45 IC1.5
  Bottom 0.406: Q2.2 26.04,66.67 26.04,60.33 41.91,44.45
OUTPUT-7
  Bottom 0.406: Q1.2 26.67,80.01 29.21,77.47 29.21,72.39 27.3,70.48 27.3,62.23 42.55,46.99 IC1.4
RX
  Bottom 0.406: 46.99,52.07 IC1.2 48.26,52.07 49.53,53.34 49.53,55.88 52.07,58.42 55.88,58.42 60.96,63.5 JP5.2
TX
  Top 0.4: IC1.3 48.26,49.53 48.26,55.88 46.99,57.15 44.45,57.15 39.37,62.23
  Top 0.406: 39.37,62.23 CN1.5
V+
  Top 0.813: X7.1' 83.82,82.55 83.82,72.39 | 83.82,19.05 83.82,8.89 X8.7' | 83.82,29.21 83.82,39.37 | 83.82,39.37 83.82,52.07 | 83.82,52.07 83.82,62.23 | 83.82,62.23 83.82,71.12 | 83.82,71.12 83.82,72.39 | 83.82,72.39 X7.3' | 83.82,62.23 X7.5' | 83.82,52.07 X7.7' | 83.82,39.37 X8.1' | 83.82,29.21 X8.3' | 83.82,19.05 83.82,29.21 | 83.82,19.05 X8.5' | 83.82,71.12 69.85,71.12 JP6.1
  Bottom 0.813: D110.C 71.31,73.66 67.31,73.66 JP6.1
  Bottom 1.778: F105.1 73.17,87.63 69.85,87.63 | 69.85,87.63 F104.1 | D110.C 69.85,85.28 69.85,87.63
ZONE_BUS
  Bottom 0.254: JP3.1 57.15,19.05
  Bottom 0.813: R104.2 59.05,6.35 57.15,8.26 57.15,12.7 54.61,15.24 | 54.61,15.24 45.72,15.24 JP1.1 | 54.61,15.24 55.88,15.24 JP3.1
ZONE_EXTERNAL
  Top 1.778: X5.1' X5.2'
  Bottom 0.813: X5.1' 64.77,8.04 R104.1

### Text on the board
Tinfo: +24VDC | GND | INPUTS | +5VDC | GND | +24VDC | GND | OUTPUTS | O7 | V+ | GND connect | +24VDC connect | V+ | I7 | O6 | V+ | GND | FTDI | 1 | RESET | rx | V+ | I6 | O5 | V+ | input | V+ | I5 | O4 | V+ | V+ | I4 | Residential | Light Control Unit | Piet De Vaere | piet@devae.re | https://github.com/pietdevaere/firefly | O3 | V+ | V+ | I3 | O2 | V+ | V+ | I2 | O1 | OUTPUTS 0..7 | V+ | V+ | I1 | O0 | V+ | V+ | I0 | All Bus | Zone Bus | INPUTS0..7